# Altium schematic sheet Contactors.SchDoc
size A
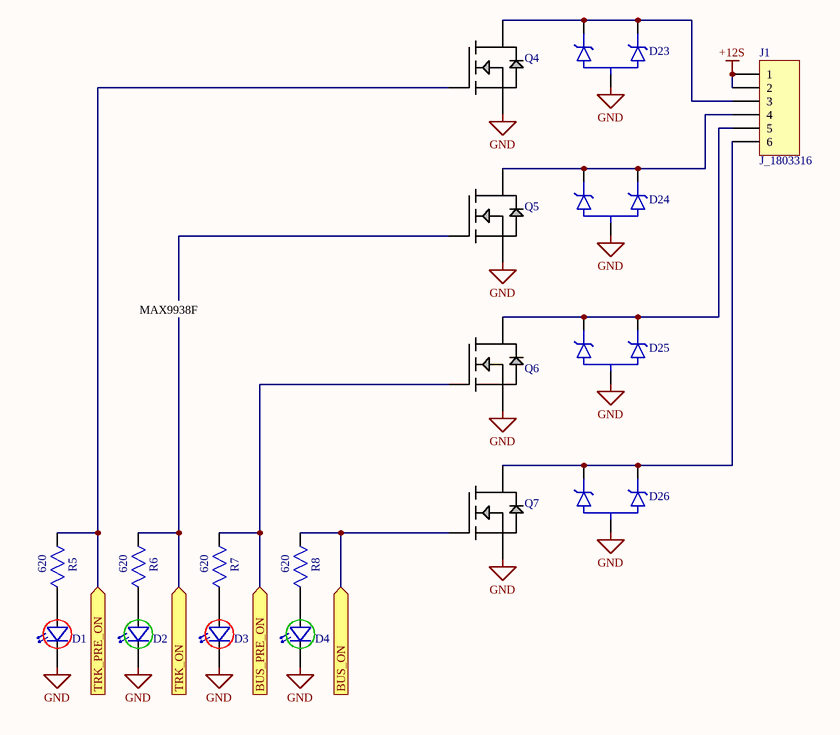
[diagram p0: Contactors.SchDoc]

## Parts
D1  D_LED_0805_RED  [0805P_RED]  (value not drawn)
D2  D_LED_0805_GREEN  [0805P_Green]  (value not drawn)
D3  D_LED_0805_RED  [0805P_RED]  (value not drawn)
D4  D_LED_0805_GREEN  [0805P_Green]  (value not drawn)
D23  D_AZ23C36-TP  [SOT-23]  (value not drawn)
D24  D_AZ23C36-TP  [SOT-23]  (value not drawn)
D25  D_AZ23C36-TP  [SOT-23]  (value not drawn)
D26  D_AZ23C36-TP  [SOT-23]  (value not drawn)
J1  J_1803316  [1844252]
Q4  RK7002BT116  [SOT-23]  (value not drawn)
Q5  RK7002BT116  [SOT-23]  (value not drawn)
Q6  RK7002BT116  [SOT-23]  (value not drawn)
Q7  RK7002BT116  [SOT-23]  (value not drawn)
R5  value 620  [0603_res]  (hidden comment: R_0805_620_1%)
R6  value 620  [0603_res]  (hidden comment: R_0805_620_1%)
R7  value 620  [0603_res]  (hidden comment: R_0805_620_1%)
R8  value 620  [0603_res]  (hidden comment: R_0805_620_1%)

## Ports
BUS_ON, BUS_PRE_ON, TRK_ON, TRK_PRE_ON

## Nets
+12S: J1.1 J1.2
GND: D1.1(Cathode) D2.1(Cathode) D3.1(Cathode) D4.1(Cathode) D23.3(ANODE) D24.3(ANODE) D25.3(ANODE) D26.3(ANODE) Q4.2(SOURCE) Q5.2(SOURCE) Q6.2(SOURCE) Q7.2(SOURCE)
BUS_ON: Q7.1(GATE) R8.2 ; port BUS_ON
BUS_PRE_ON: Q6.1(GATE) R7.2 ; port BUS_PRE_ON
TRK_ON: Q5.1(GATE) R6.2 ; port TRK_ON
TRK_PRE_ON: Q4.1(GATE) R5.2 ; port TRK_PRE_ON
NetD1_2: D1.2(Anode) R5.1
NetD2_2: D2.2(Anode) R6.1
NetD3_2: D3.2(Anode) R7.1
NetD4_2: D4.2(Anode) R8.1
NetD23_1: D23.1(CATHODE_1) D23.2(CATHODE_2) J1.3 Q4.3(DRAIN)
NetD24_1: D24.1(CATHODE_1) D24.2(CATHODE_2) J1.4 Q5.3(DRAIN)
NetD25_1: D25.1(CATHODE_1) D25.2(CATHODE_2) J1.5 Q6.3(DRAIN)
NetD26_1: D26.1(CATHODE_1) D26.2(CATHODE_2) J1.6 Q7.3(DRAIN)

## Notes on the sheet
- MAX9938F

## Library data of the parts
D1 D3 = D_LED_0805_RED: LED CHIPLED 645NM RED DIFF 0805; SVP Creator: Jonathan Nutzmann; Current: 20mA; Forward Voltage: 1.8; Package: 0805; Known Distributors: Digikey; Value: RED; ComponentLink1Description: Datasheet
D2 D4 = D_LED_0805_GREEN: LED CHIPLED 570NM GREEN 0805 SMD; Manufacturer: Osram Opto Semiconductors Inc; Manufacturer PN: LG R971-KN-1-0-20-R18; SVP Creator: Nate Bolyard; SVP Reviewer 1: Trevtron; Current: 20mA; Forward Voltage: 2.2V; Package: 0805; Known Distributors: Digikey; Value: GREEN; HelpURL: http://umnsvp.dyndns.org/svn/centaurus2/datasheets/common parts/LG_R971.pdf; ComponentLink1URL: http://umnsvp.dyndns.org/svn/centaurus2/datasheets/common parts/LG_R971.pdf; ComponentLink1Description: Datasheet
D23-D26 = D_AZ23C36-TP: DIODE ZENER DUAL 36V SOT-23; Manufacturer: Micro; SVP Creator: Jonathan Nutzmann; Package: SOT-23-3; Known Distributors: Digikey; Manufacturer PN: AZ23C36-TP; HelpURL: http://umnsvp.dyndns.org/svn/centaurus2/datasheets/; ComponentLink1URL: http://umnsvp.dyndns.org/svn/centaurus2/datasheets/; ComponentLink1Description: Datasheet
J1 = J_1803316: CONN HEADER RT ANG 6POS 3.81MM; Manufacturer: Phoenix Contact; Manufacturer PN: 1844252
Q4-Q7 = Q_N_60V_250MA_SOT23: MOSFET N-CH 60V 250MA SOT-23; Manufacturer: Rohm Semiconductor; SVP Creator: Jonathan Nutzmann; Package: SOT-23-3; Known Distributors: Digikey; Manufacturer PN: RK7002BT116; Price: .13@25; ComponentLink1Description: Datasheet
R5-R8 = R_0805_620_1%: RES 620 OHM 1/8W 1% 0603 SMD; Power Rating: .125W; SVP Creator: Jonathan Nutzmann; Package: 0805; Known Distributor: Digikey; ComponentLink1Description: Datasheet